# EAGLE schematic Powerboard (EAGLE 8.3.2)
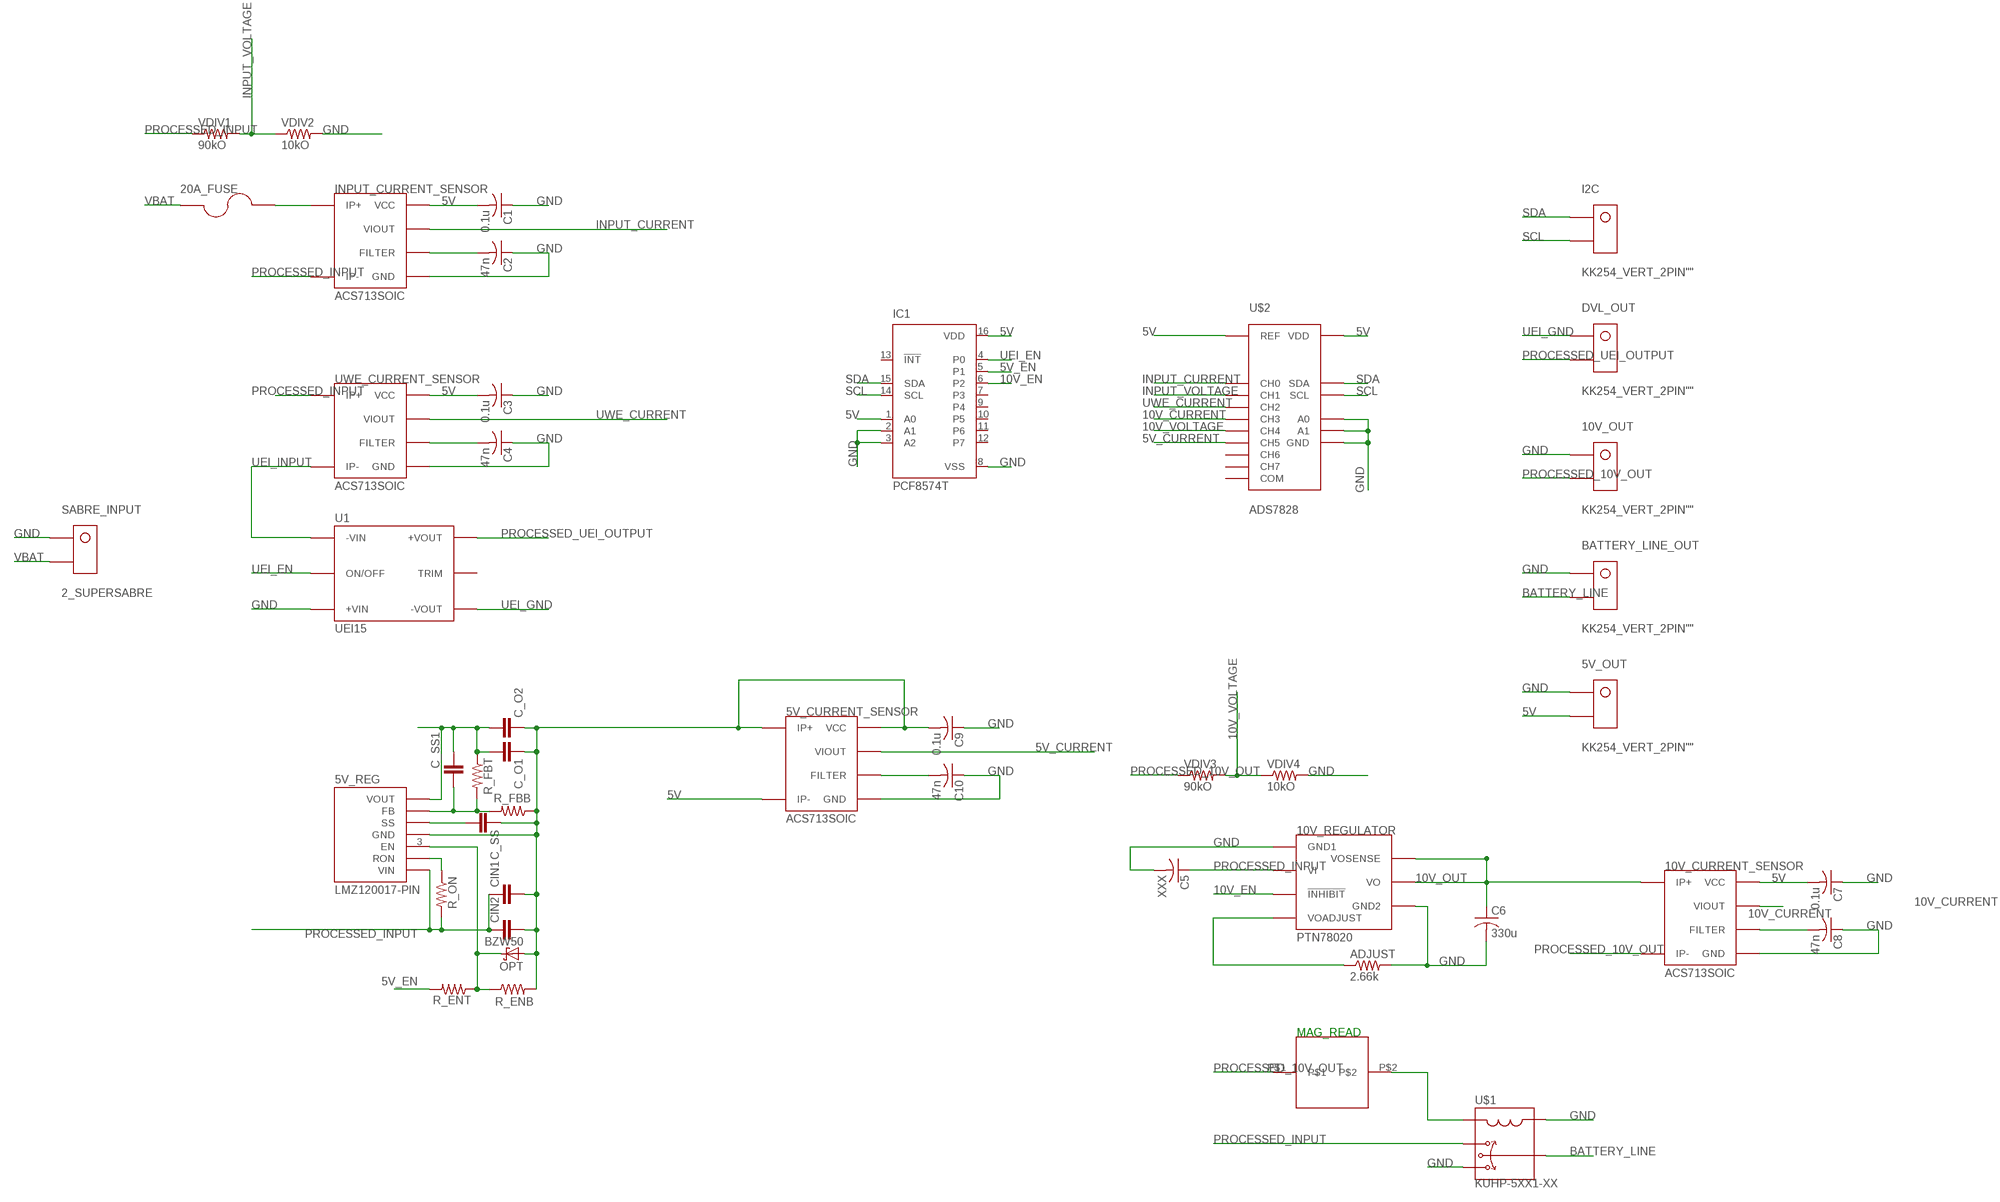
[diagram p0: schematic, sheet 1]

## Parts
5V_CURRENT_SENSOR  ACS713SOIC  [ACS713-SOIC]
5V_OUT  KK254_VERT_2PIN""  [KK254_VERT_2PIN]
5V_REG  LMZ120017-PIN  [LMZ12001]
10V_CURRENT_SENSOR  ACS713SOIC  [ACS713-SOIC]
10V_OUT  KK254_VERT_2PIN""  [KK254_VERT_2PIN]
10V_REGULATOR  PTN78020  [PTN]
20A_FUSE  BOWED-1.25"-FUSECLIPS  [1.25"_FUSECLIPS]
ADJUST  2.66k  R-US_R0805  [R0805]
BATTERY_LINE_OUT  KK254_VERT_2PIN""  [KK254_VERT_2PIN]
C1  0.1u  C-USC0805  [C0805]
C2  47n  C-USC0805  [C0805]
C3  0.1u  C-USC0805  [C0805]
C4  47n  C-USC0805  [C0805]
C5  XXX  C-USC0805  [C0805]
C6  330u  C-USC0805  [C0805]
C7  0.1u  C-USC0805  [C0805]
C8  47n  C-USC0805  [C0805]
C9  0.1u  C-USC0805  [C0805]
C10  47n  C-USC0805  [C0805]
C_O1  C5/3.5  [C5B3.5]
C_O2  C5/3.5  [C5B3.5]
C_SS  C5/3.5  [C5B3.5]
C_SS1  C5/3.5  [C5B3.5]
CIN1  C5/3.5  [C5B3.5]
CIN2  C5/3.5  [C5B3.5]
DVL_OUT  KK254_VERT_2PIN""  [KK254_VERT_2PIN]
I2C  KK254_VERT_2PIN""  [KK254_VERT_2PIN]
IC1  PCF8574T  [SO16W]
INPUT_CURRENT_SENSOR  ACS713SOIC  [ACS713-SOIC]
MAGREAD  HE151TR-ND  [HE151TR-ND]
OPT  BZW50  [AG]
R_ENB  R-US_R0805  [R0805]
R_ENT  R-US_R0805  [R0805]
R_FBB  R-US_R0805  [R0805]
R_FBT  R-US_R0805  [R0805]
R_ON  R-US_R0805  [R0805]
SABRE_INPUT  2_SUPERSABRE  [SUPERSABRE_2CIRCUIT]
U1  UEI15  [UEI15]
U$1  KUHP-5XX1-XX  [KUHP_6.35MM-QUICK-CONNECT]
U$2  ADS7828  [TSSOP16]
UWE_CURRENT_SENSOR  ACS713SOIC  [ACS713-SOIC]
VDIV1  90kO  R-US_R0805  [R0805]
VDIV2  10kO  R-US_R0805  [R0805]
VDIV3  90kO  R-US_R0805  [R0805]
VDIV4  10kO  R-US_R0805  [R0805]

## Nets
5V: 5V_CURRENT_SENSOR.P$3(IP-) 5V_CURRENT_SENSOR.P$4(IP-) 5V_OUT.P$2 10V_CURRENT_SENSOR.P$8(VCC) C1.2 C3.2 C7.2 IC1.1(A0) IC1.16(VDD) INPUT_CURRENT_SENSOR.P$8(VCC) U$2.10(REF) U$2.16(VDD) UWE_CURRENT_SENSOR.P$8(VCC)
5V_CURRENT: 5V_CURRENT_SENSOR.P$7(VIOUT) U$2.6(CH5)
5V_EN: IC1.5(P1) R_ENT.2
10V_CURRENT: 10V_CURRENT_SENSOR.P$7(VIOUT) U$2.4(CH3)
10V_EN: 10V_REGULATOR.INHIBIT(!INHIBIT!) IC1.6(P2)
10V_OUT: 10V_CURRENT_SENSOR.P$1(IP+) 10V_CURRENT_SENSOR.P$2(IP+) 10V_REGULATOR.SENSE(VOSENSE) 10V_REGULATOR.VOUT(VO) C6.1
10V_VOLTAGE: U$2.5(CH4) VDIV3.2 VDIV4.1
BATTERY_LINE: BATTERY_LINE_OUT.P$2 U$1.7A U$1.7B
GND: 5V_CURRENT_SENSOR.P$5(GND) 5V_OUT.P$1 10V_CURRENT_SENSOR.P$5(GND) 10V_OUT.P$1 10V_REGULATOR.GND1 10V_REGULATOR.GND2 ADJUST.2 BATTERY_LINE_OUT.P$1 C1.1 C2.1 C3.1 C4.1 C5.2 C6.2 C7.1 C8.1 C9.1 C10.1 IC1.2(A1) IC1.3(A2) IC1.8(VSS) INPUT_CURRENT_SENSOR.P$5(GND) SABRE_INPUT.P$1 U1.P$6(+VIN) U$1.5A U$1.5B U$1.AA(A) U$1.AB(A) U$2.9(GND) U$2.12(A0) U$2.13(A1) UWE_CURRENT_SENSOR.P$5(GND) VDIV2.2 VDIV4.2
INPUT_CURRENT: INPUT_CURRENT_SENSOR.P$7(VIOUT) U$2.1(CH0)
INPUT_VOLTAGE: U$2.2(CH1) VDIV1.2 VDIV2.1
N$1: 20A_FUSE.P$3 20A_FUSE.P$4 INPUT_CURRENT_SENSOR.P$1(IP+) INPUT_CURRENT_SENSOR.P$2(IP+)
N$2: C2.2 INPUT_CURRENT_SENSOR.P$6(FILTER)
N$3: 5V_CURRENT_SENSOR.P$6(FILTER) C10.2
N$5: 10V_REGULATOR.ADJUST(VOADJUST) ADJUST.1
N$7: C4.2 UWE_CURRENT_SENSOR.P$6(FILTER)
N$9: MAGREAD.P$2 U$1.BA(B) U$1.BB(B)
N$10: 10V_CURRENT_SENSOR.P$6(FILTER) C8.2
N$12: 5V_REG.2(RON) R_ON.1
N$13: 5V_REG.5(SS) C_SS.2
N$15: 5V_REG.7(VOUT) C_O1.2 C_O2.2 C_SS1.1 R_FBT.1
N$16: 5V_REG.3(EN) OPT.C R_ENB.1 R_ENT.1
N$17: 5V_REG.6(FB) C_SS1.2 R_FBB.2 R_FBT.2
PROCESSED_10V_OUT: 10V_CURRENT_SENSOR.P$3(IP-) 10V_CURRENT_SENSOR.P$4(IP-) 10V_OUT.P$2 MAGREAD.P$1 VDIV3.1
PROCESSED_INPUT: 5V_CURRENT_SENSOR.P$1(IP+) 5V_CURRENT_SENSOR.P$2(IP+) 5V_CURRENT_SENSOR.P$8(VCC) 5V_REG.1(VIN) 5V_REG.4(GND) 10V_REGULATOR.VIN(VI) C5.1 C9.2 C_O1.1 C_O2.1 C_SS.1 CIN1.1 CIN1.2 CIN2.1 CIN2.2 INPUT_CURRENT_SENSOR.P$3(IP-) INPUT_CURRENT_SENSOR.P$4(IP-) OPT.A R_ENB.2 R_FBB.1 R_ON.2 U$1.2A U$1.2B UWE_CURRENT_SENSOR.P$1(IP+) UWE_CURRENT_SENSOR.P$2(IP+) VDIV1.1
PROCESSED_UEI_OUTPUT: DVL_OUT.P$2 U1.P$1(+VOUT)
SCL: I2C.P$2 IC1.14(SCL) U$2.14(SCL)
SDA: I2C.P$1 IC1.15(SDA) U$2.15(SDA)
UEI_EN: IC1.4(P0) U1.P$4(ON/OFF)
UEI_GND: DVL_OUT.P$1 U1.P$3(-VOUT)
UEI_INPUT: U1.P$5(-VIN) UWE_CURRENT_SENSOR.P$3(IP-) UWE_CURRENT_SENSOR.P$4(IP-)
UWE_CURRENT: U$2.3(CH2) UWE_CURRENT_SENSOR.P$7(VIOUT)
VBAT: 20A_FUSE.P$1 20A_FUSE.P$2 SABRE_INPUT.P$2
Unconnected: IC1.7(P3) IC1.9(P4) IC1.10(P5) IC1.11(P6) IC1.12(P7) IC1.13(!INT) U1.P$2(TRIM) U$2.7(CH6) U$2.8(CH7) U$2.11(COM)

## Notes on the sheet
- MAG_READ

## Library data of the parts
5V_CURRENT_SENSOR 10V_CURRENT_SENSOR INPUT_CURRENT_SENSOR UWE_CURRENT_SENSOR = allegro:ACS713
5V_OUT 10V_OUT BATTERY_LINE_OUT DVL_OUT I2C = molex:KK254_VERT_2PIN: KK® 254 Wire-to-Board Header, Vertical, with Friction Lock, 2 Circuits, Gold (Au) Plating Part Number: 22-29-2021 http://www.molex.com/molex/products/datasheet.jsp?part=active/0022292021_PCB_HEADERS.xml
5V_REG = texas:LMZ12001: The LMZ12001 SIMPLE SWITCHER power module is a step-down DC-DC solution capable of driving up to 1-A load.
10V_REGULATOR = texas:PTN
20A_FUSE = littelfuse:BOWED-1.25"-FUSECLIPS: Littelfuse 1.25" fuse clips with bowed leads
ADJUST R_ENB R_ENT R_FBB R_FBT R_ON VDIV1-VDIV4 = resistor:R-US_: RESISTOR, American symbol
C1-C10 = resistor:C-US: CAPACITOR, American symbol
C_O1 C_O2 C_SS C_SS1 CIN1 CIN2 = capacitor-wima:C: CAPACITOR naming: grid - package width
IC1 = texas:PCF8574: I2C-Bus Remote 8-bit I/O expander http://www.semiconductors.philips.com/acrobat_download/datasheets/PCF8574_4.pdf; MPN: PCF8574T/3,512; OC_FARNELL: 1201255; OC_NEWARK: 70R6870
MAGREAD = magReed:HE151TR-ND
OPT = diode:BZW50: DIODE
SABRE_INPUT = molex:2_SUPERSABRE: Molex SuperSabre 2-pin vertical header
U1 = murata:UEI15: The Murata UEI15 is an isolated wide input range 15W DC/DC Converter https://power.murata.com/data/power/mdc_uei-15w.pdf
U$1 = TE:KUHP-5XX1-XX: TE Connectivity KUHP-Series Relay Panel relays with quick-connect terminals Relay Datasheet <http://www.mouser.com/ds/2/418/NG_DS_1308242_KUHP_0914_KUHP_0914-713261.pdf> IMPORTANT NOTE: This part is designed using female PCB-mount spade terminals. Part: Keystone Electronics 0.25"x0.032" PC quick-fit terminals (Part No. 3528). Datasheet <http://www.mouser.com/ds/2/215/528-745365.pdf>
U$2 = texas:ADS7828: Texas Instruments ADS7828 8-channel 12-bit I2C ADC Datasheet <http://www.ti.com/lit/ds/symlink/ads7828.pdf>